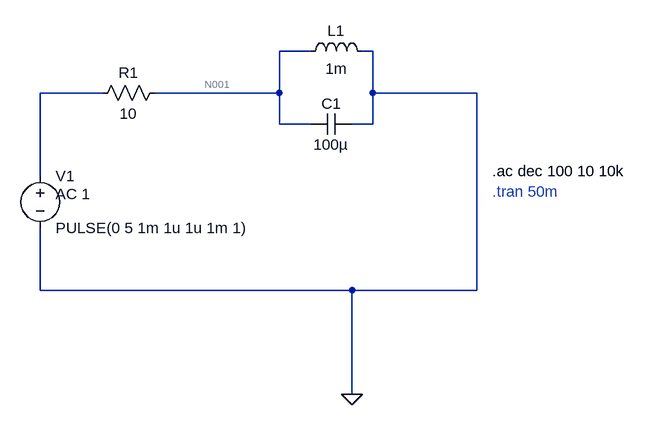
[diagram p0: schematic scm1.asc]
scm1.asc, the LTspice schematic file:
Version 4.1
SHEET 1 1284 680
WIRE 400 -384 352 -384
WIRE 496 -384 480 -384
WIRE 80 -320 -16 -320
WIRE 352 -320 352 -384
WIRE 352 -320 160 -320
WIRE 496 -320 496 -384
WIRE 656 -320 496 -320
WIRE 352 -272 352 -320
WIRE 400 -272 352 -272
WIRE 496 -272 496 -320
WIRE 496 -272 464 -272
WIRE -16 -192 -16 -320
WIRE -16 -16 -16 -112
WIRE 464 -16 -16 -16
WIRE 656 -16 656 -320
WIRE 656 -16 464 -16
WIRE 464 144 464 -16
FLAG 464 144 0
SYMBOL voltage -16 -208 R0
WINDOW 123 24 44 Left 2
WINDOW 39 0 0 Left 0
SYMATTR InstName V1
SYMATTR Value PULSE(0 5 1m 1u 1u 1m 1)
SYMATTR Value2 AC 1
SYMBOL ind 384 -368 R270
WINDOW 0 32 56 VTop 2
WINDOW 3 5 56 VBottom 2
SYMATTR InstName L1
SYMATTR Value 1m
SYMATTR SpiceLine Rser=1m
SYMBOL cap 464 -288 R90
WINDOW 0 0 32 VBottom 2
WINDOW 3 32 32 VTop 2
SYMATTR InstName C1
SYMATTR Value 100µ
SYMBOL res 176 -336 R90
WINDOW 0 0 56 VBottom 2
WINDOW 3 32 56 VTop 2
SYMATTR InstName R1
SYMATTR Value 10
TEXT 680 -200 Left 2 !.ac dec 100 10 10k
TEXT 680 -168 Left 2 ;.tran 50m

The netlist it stands for:
* scm1.asc
V1 N002 0 PULSE(0 5 1m 1u 1u 1m 1) AC 1
L1 N001 0 1m Rser=1m
C1 0 N001 100µ
R1 N001 N002 10
.ac dec 100 10 10k
* .tran 50m
.backanno
.end

* Results of the author's LTspice run, read from the files saved beside the schematic
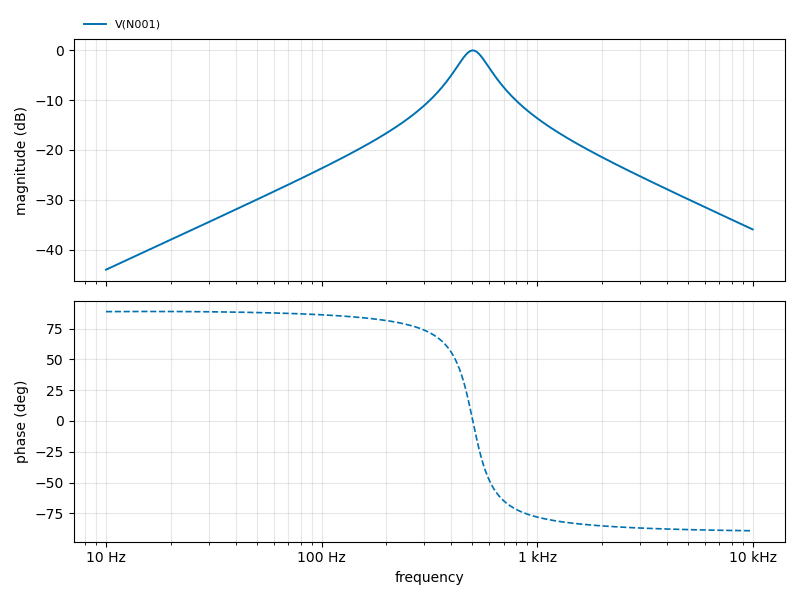
[diagram p1: AC Analysis of scm1.asc, plotted from the saved traces]
* AC Analysis, 1 run:
*   V(N001): -44.03 dB at 10 Hz, -35.94 dB at 10 kHz, peak -0.01 dB at 501.2 Hz, 3 dB below the peak at 429.9 Hz and 589.3 Hz